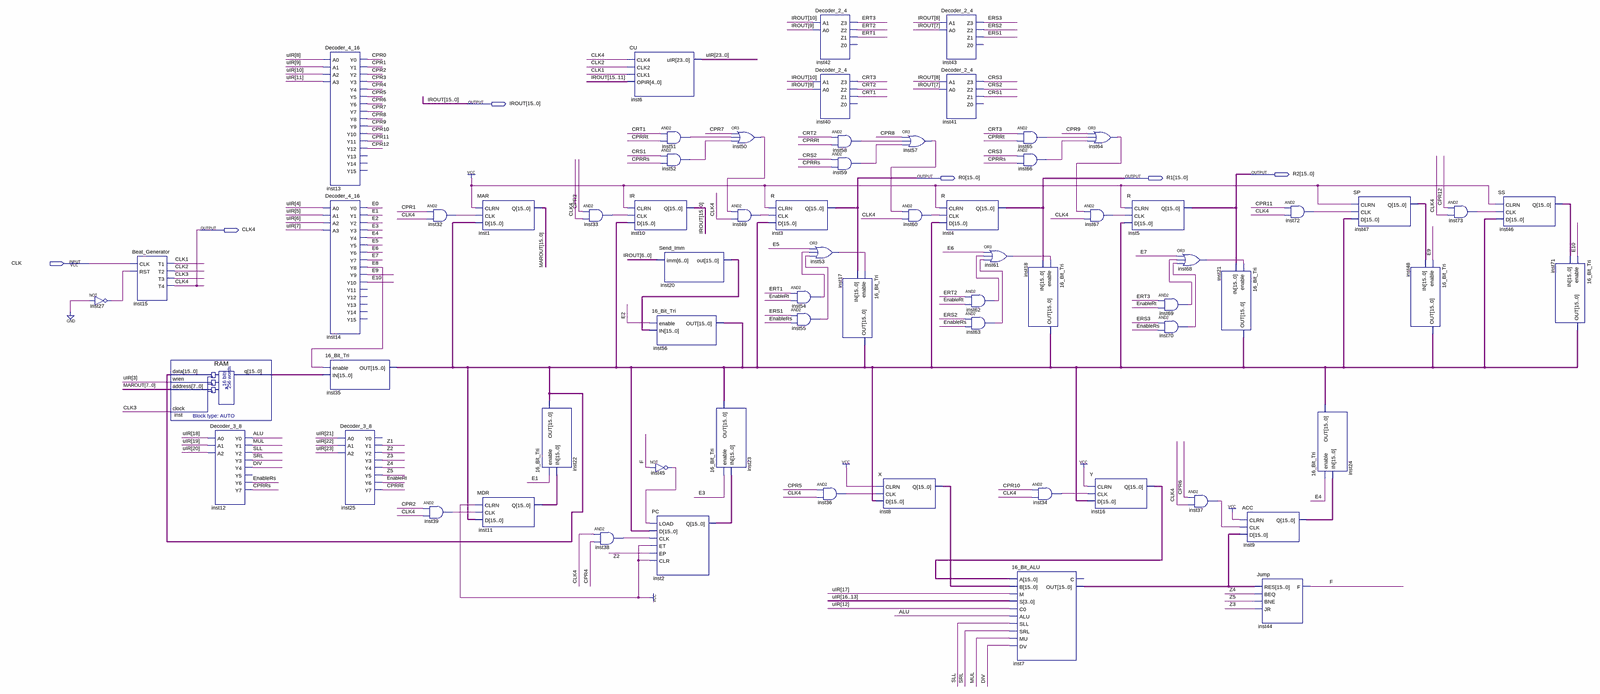
[diagram p0: schematic sheet, whole]
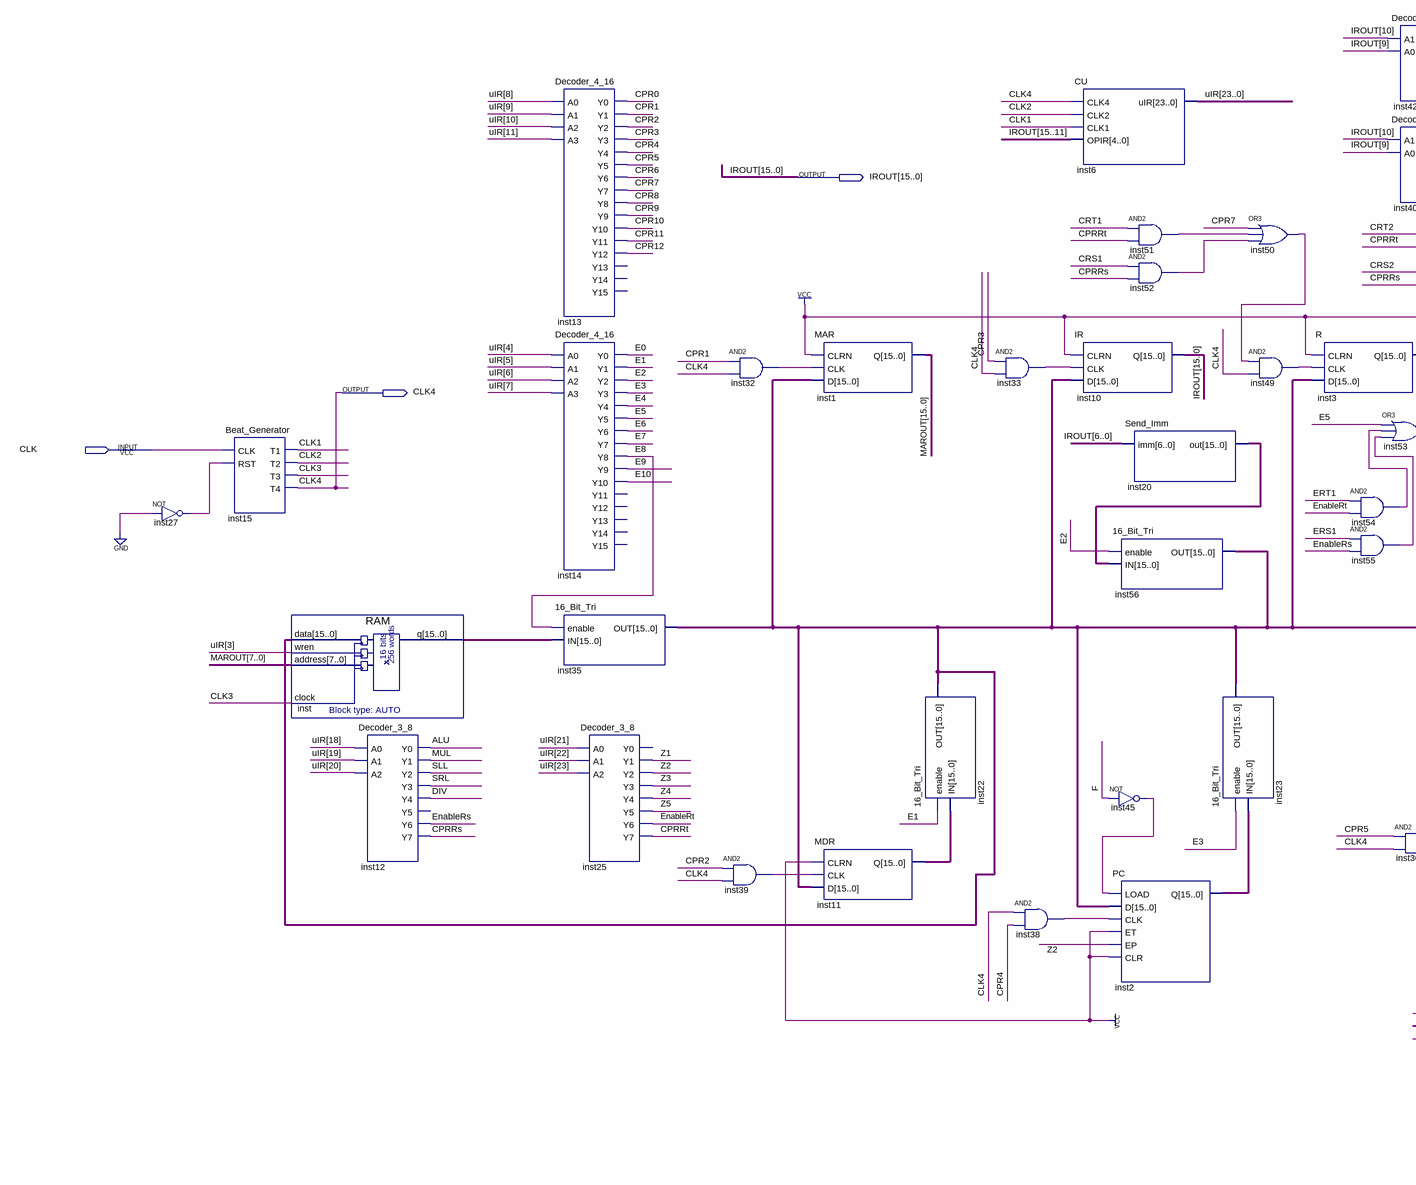
[diagram p1: schematic sheet, left part]
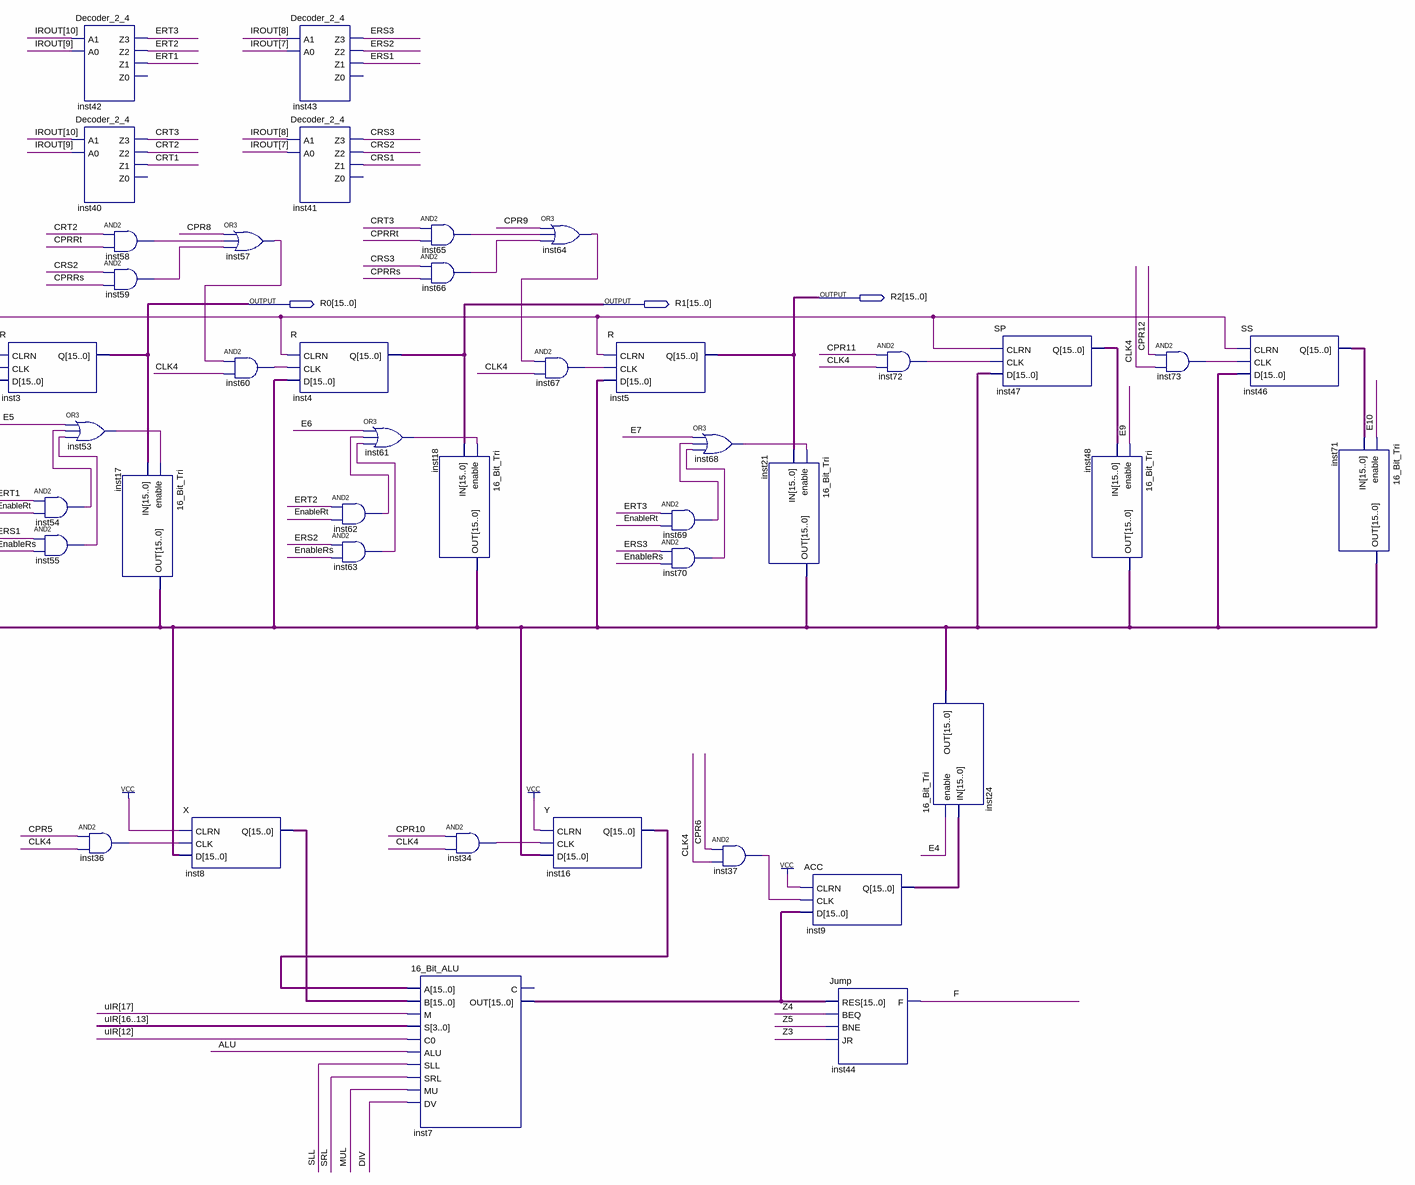
[diagram p2: schematic sheet, right part]
// Quartus schematic Lab3.bdf as structural Verilog: 68 symbols, 6 pins
module Lab3 (
  input  CLK,
  output [15:0] IROUT,
  output [15:0] R2,
  output [15:0] R0,
  output [15:0] R1,
  output CLK4
);

  wire ALU, CLK1, CLK2, CLK3, CPR0, CPR1, CPR2, CPR3, CPR4, CPR5, CPR6, CPR7, CPR8, CPR9, CPR10, CPR11,
       CPR12, CPRRs, CPRRt, CRS1, CRS2, CRS3, CRT1, CRT2, CRT3, DIV, E0, E1, E2, E3, E4, E5, E6, E7, E8, E9,
       E10, EnableRs, EnableRt, ERS1, ERS2, ERS3, ERT1, ERT2, ERT3, F, inst27_out, inst32_out, inst33_out,
       inst34_out, inst36_out, inst37_out, inst38_out, inst39_out, inst45_out, inst49_out, inst50_out,
       inst51_out, inst52_out, inst53_out, inst54_out, inst55_out, inst57_out, inst58_out, inst59_out,
       inst60_out, inst61_out, inst62_out, inst63_out, inst64_out, inst65_out, inst66_out, inst67_out,
       inst68_out, inst69_out, inst70_out, inst72_out, inst73_out, MUL, SLL, SRL, Z1, Z2, Z3, Z4, Z5;
  wire [15:0] inst2_q, inst7_out, inst8_q, inst9_q, inst11_q, inst16_q, inst20_out, inst35_out, inst46_q,
       inst47_q, inst_q, MAROUT;
  wire [23:0] uIR;

  not inst27 (inst27_out, 1'b0);
  Beat_Generator inst15 (.CLK(CLK), .RST(inst27_out), .T1(CLK1), .T2(CLK2), .T3(CLK3), .T4(CLK4));
  RAM inst (.data(inst35_out), .wren(uIR[3]), .address(MAROUT[7:0]), .clock(CLK3), .q(inst_q));
  Decoder_3_8 inst12 (
    .A0(uIR[18]), .A1(uIR[19]), .A2(uIR[20]), .Y0(ALU), .Y1(MUL), .Y2(SLL), .Y3(SRL), .Y4(DIV),
    .Y6(EnableRs), .Y7(CPRRs));  // open: Y5
  Decoder_4_16 inst13 (
    .A0(uIR[8]), .A1(uIR[9]), .A2(uIR[10]), .A3(uIR[11]), .Y0(CPR0), .Y1(CPR1), .Y2(CPR2), .Y3(CPR3),
    .Y4(CPR4), .Y5(CPR5), .Y6(CPR6), .Y7(CPR7), .Y8(CPR8), .Y9(CPR9), .Y10(CPR10), .Y11(CPR11), .Y12(CPR12));  // open: Y13, Y14, Y15
  Decoder_4_16 inst14 (
    .A0(uIR[4]), .A1(uIR[5]), .A2(uIR[6]), .A3(uIR[7]), .Y0(E0), .Y1(E1), .Y2(E2), .Y3(E3), .Y4(E4), .Y5(E5),
    .Y6(E6), .Y7(E7), .Y8(E8), .Y9(E9), .Y10(E10));  // open: Y11, Y12, Y13, Y14, Y15
  \16_Bit_Tri  inst35 (.enable(E8), .IN(inst_q), .OUT(inst35_out));
  Decoder_3_8 inst25 (
    .A0(uIR[21]), .A1(uIR[22]), .A2(uIR[23]), .Y1(Z1), .Y2(Z2), .Y3(Z3), .Y4(Z4), .Y5(Z5), .Y6(EnableRt),
    .Y7(CPRRt));  // open: Y0
  and inst32 (inst32_out, CPR1, CLK4);
  and inst39 (inst39_out, CPR2, CLK4);
  MAR inst1 (.CLRN(1'b1), .CLK(inst32_out), .D(inst35_out), .Q(MAROUT));
  MDR inst11 (.CLRN(1'b1), .CLK(inst39_out), .D(inst35_out), .Q(inst11_q));
  \16_Bit_Tri  inst22 (.enable(E1), .IN(inst11_q), .OUT(inst35_out));
  and inst33 (inst33_out, CPR3, CLK4);
  and inst38 (inst38_out, CLK4, CPR4);
  CU inst6 (.CLK4(CLK4), .CLK2(CLK2), .CLK1(CLK1), .OPIR(IROUT[15:11]), .uIR(uIR));
  IR inst10 (.CLRN(1'b1), .CLK(inst33_out), .D(inst35_out), .Q(IROUT));
  \16_Bit_Tri  inst56 (.enable(E2), .IN(inst20_out), .OUT(inst35_out));
  not inst45 (inst45_out, F);
  PC inst2 (.LOAD(inst45_out), .D(inst35_out), .CLK(inst38_out), .ET(1'b1), .EP(Z2), .CLR(1'b1), .Q(inst2_q));
  and inst51 (inst51_out, CRT1, CPRRt);
  and inst52 (inst52_out, CRS1, CPRRs);
  Send_Imm inst20 (.imm(IROUT[6:0]), .out(inst20_out));
  \16_Bit_Tri  inst23 (.enable(E3), .IN(inst2_q), .OUT(inst35_out));
  or inst50 (inst50_out, CPR7, inst51_out, inst52_out);
  and inst49 (inst49_out, inst50_out, CLK4);
  R inst3 (.CLRN(1'b1), .CLK(inst49_out), .D(inst35_out), .Q(R0));
  and inst54 (inst54_out, ERT1, EnableRt);
  and inst55 (inst55_out, ERS1, EnableRs);
  Decoder_2_4 inst42 (.A1(IROUT[10]), .A0(IROUT[9]), .Z3(ERT3), .Z2(ERT2), .Z1(ERT1));  // open: Z0
  Decoder_2_4 inst40 (.A1(IROUT[10]), .A0(IROUT[9]), .Z3(CRT3), .Z2(CRT2), .Z1(CRT1));  // open: Z0
  and inst58 (inst58_out, CRT2, CPRRt);
  and inst59 (inst59_out, CRS2, CPRRs);
  or inst53 (inst53_out, E5, inst54_out, inst55_out);
  and inst36 (inst36_out, CPR5, CLK4);
  \16_Bit_Tri  inst17 (.enable(inst53_out), .IN(R0), .OUT(inst35_out));
  X inst8 (.CLRN(1'b1), .CLK(inst36_out), .D(inst35_out), .Q(inst8_q));
  or inst57 (inst57_out, CPR8, inst58_out, inst59_out);
  and inst60 (inst60_out, inst57_out, CLK4);
  Decoder_2_4 inst43 (.A1(IROUT[8]), .A0(IROUT[7]), .Z3(ERS3), .Z2(ERS2), .Z1(ERS1));  // open: Z0
  Decoder_2_4 inst41 (.A1(IROUT[8]), .A0(IROUT[7]), .Z3(CRS3), .Z2(CRS2), .Z1(CRS1));  // open: Z0
  R inst4 (.CLRN(1'b1), .CLK(inst60_out), .D(inst35_out), .Q(R1));
  and inst62 (inst62_out, ERT2, EnableRt);
  and inst63 (inst63_out, ERS2, EnableRs);
  or inst61 (inst61_out, E6, inst62_out, inst63_out);
  \16_Bit_ALU  inst7 (
    .A(inst16_q), .B(inst8_q), .M(uIR[17]), .S(uIR[16:13]), .C0(uIR[12]), .ALU(ALU), .SLL(SLL), .SRL(SRL),
    .MU(MUL), .DV(DIV), .OUT(inst7_out));  // open: C
  and inst65 (inst65_out, CRT3, CPRRt);
  and inst66 (inst66_out, CRS3, CPRRs);
  \16_Bit_Tri  inst18 (.enable(inst61_out), .IN(R1), .OUT(inst35_out));
  and inst34 (inst34_out, CPR10, CLK4);
  or inst64 (inst64_out, CPR9, inst65_out, inst66_out);
  and inst67 (inst67_out, inst64_out, CLK4);
  Y inst16 (.CLRN(1'b1), .CLK(inst34_out), .D(inst35_out), .Q(inst16_q));
  R inst5 (.CLRN(1'b1), .CLK(inst67_out), .D(inst35_out), .Q(R2));
  and inst69 (inst69_out, ERT3, EnableRt);
  and inst70 (inst70_out, ERS3, EnableRs);
  or inst68 (inst68_out, E7, inst69_out, inst70_out);
  and inst37 (inst37_out, CPR6, CLK4);
  \16_Bit_Tri  inst21 (.enable(inst68_out), .IN(R2), .OUT(inst35_out));
  ACC inst9 (.CLRN(1'b1), .CLK(inst37_out), .D(inst7_out), .Q(inst9_q));
  Jump inst44 (.RES(inst7_out), .BEQ(Z4), .BNE(Z5), .JR(Z3), .F(F));
  and inst72 (inst72_out, CPR11, CLK4);
  \16_Bit_Tri  inst24 (.enable(E4), .IN(inst9_q), .OUT(inst35_out));
  SP inst47 (.CLRN(1'b1), .CLK(inst72_out), .D(inst35_out), .Q(inst47_q));
  \16_Bit_Tri  inst48 (.enable(E9), .IN(inst47_q), .OUT(inst35_out));
  and inst73 (inst73_out, CPR12, CLK4);
  SS inst46 (.CLRN(1'b1), .CLK(inst73_out), .D(inst35_out), .Q(inst46_q));
  \16_Bit_Tri  inst71 (.enable(E10), .IN(inst46_q), .OUT(inst35_out));
endmodule
